# EasyEDA schematic SCH_Piano touch sensor_2021-10-13.json
TITLE: Sheet_1; REV: 1.0; Date: 2021-10-09; Sheet: 1/1; Drawn By: limchengwei; Company: Your Company
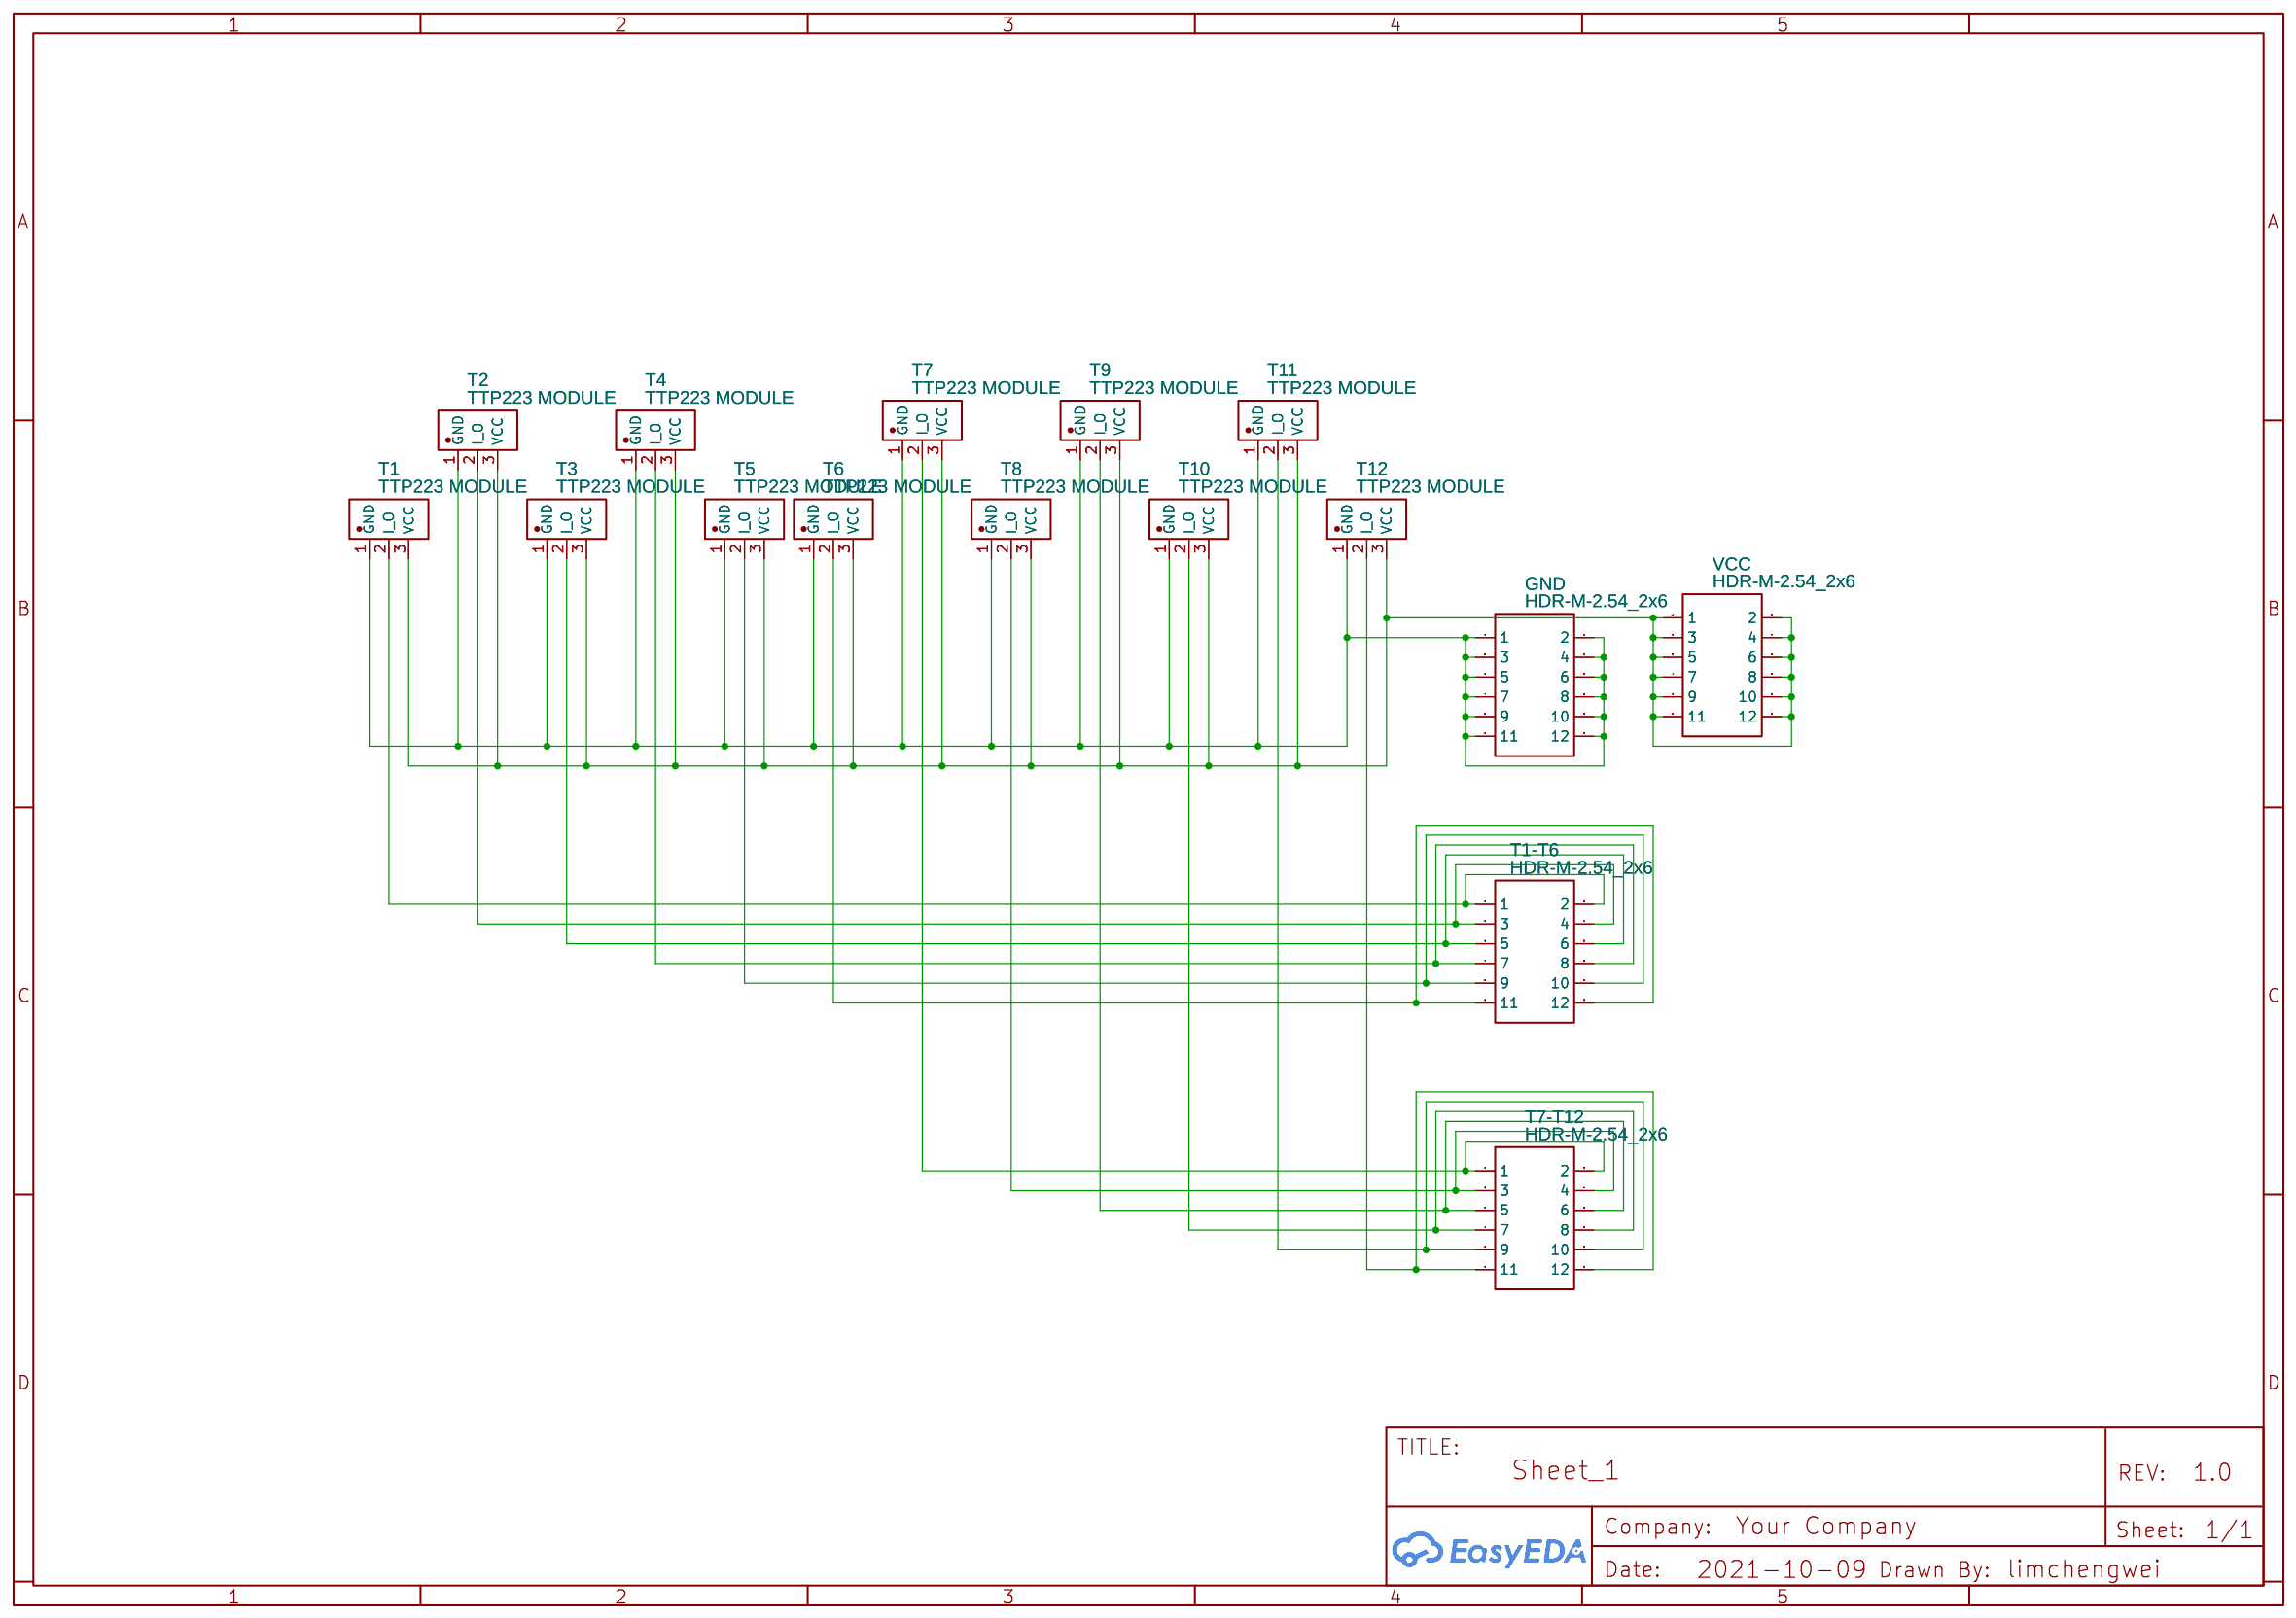
[diagram p0: schematic sheet]

## Parts
GND  HDR-M-2.54_2x6  [HDR-M-2.54_2X6]
T1  TTP223 MODULE  [TOUCH SENSOR  MODULE]
T1-T6  HDR-M-2.54_2x6  [HDR-M-2.54_2X6]
T2  TTP223 MODULE  [TOUCH SENSOR  MODULE]
T3  TTP223 MODULE  [TOUCH SENSOR  MODULE]
T4  TTP223 MODULE  [TOUCH SENSOR  MODULE]
T5  TTP223 MODULE  [TOUCH SENSOR  MODULE]
T6  TTP223 MODULE  [TOUCH SENSOR  MODULE]
T7  TTP223 MODULE  [TOUCH SENSOR  MODULE]
T7-T12  HDR-M-2.54_2x6  [HDR-M-2.54_2X6]
T8  TTP223 MODULE  [TOUCH SENSOR  MODULE]
T9  TTP223 MODULE  [TOUCH SENSOR  MODULE]
T10  TTP223 MODULE  [TOUCH SENSOR  MODULE]
T11  TTP223 MODULE  [TOUCH SENSOR  MODULE]
T12  TTP223 MODULE  [TOUCH SENSOR  MODULE]
VCC  HDR-M-2.54_2x6  [HDR-M-2.54_2X6]

## Library data of the parts
GND T1-T6 T7-T12 VCC = HDR-M-2.54_2x6: Supplier Part: C124388; Supplier: LCSC; Contributor: LCEDA_Lib
T1-T12 = TTP223 MODULE: Manufacturer: ReliaPro; Manufacturer Part: WJ2EDGVC-5.08-3P; image: //image.lceda.cn/szlcsc/C8430.jpg; Supplier Part: C8430; libConvert: Yes; Add into BOM: Yes

## Nets
Net-(GND-1): GND.1 GND.2 GND.3 GND.4 GND.5 GND.6 GND.7 GND.8 GND.9 GND.10 GND.11 GND.12 T1.1(GND) T2.1(GND) T3.1(GND) T4.1(GND) T5.1(GND) T6.1(GND) T7.1(GND) T8.1(GND) T9.1(GND) T10.1(GND) T11.1(GND) T12.1(GND)
Net-(T1-2): T1.2(I O) T1-T6.1 T1-T6.2
Net-(T1-3): T1.3(VCC) T2.3(VCC) T3.3(VCC) T4.3(VCC) T5.3(VCC) T6.3(VCC) T7.3(VCC) T8.3(VCC) T9.3(VCC) T10.3(VCC) T11.3(VCC) T12.3(VCC) VCC.1 VCC.2 VCC.3 VCC.4 VCC.5 VCC.6 VCC.7 VCC.8 VCC.9 VCC.10 VCC.11 VCC.12
Net-(T1-T6-3): T1-T6.3 T1-T6.4 T2.2(I O)
Net-(T1-T6-5): T1-T6.5 T1-T6.6 T3.2(I O)
Net-(T1-T6-7): T1-T6.7 T1-T6.8 T4.2(I O)
Net-(T1-T6-9): T1-T6.9 T1-T6.10 T5.2(I O)
Net-(T1-T6-11): T1-T6.11 T1-T6.12 T6.2(I O)
Net-(T7-2): T7.2(I O) T7-T12.1 T7-T12.2
Net-(T7-T12-3): T7-T12.3 T7-T12.4 T8.2(I O)
Net-(T7-T12-5): T7-T12.5 T7-T12.6 T9.2(I O)
Net-(T7-T12-7): T7-T12.7 T7-T12.8 T10.2(I O)
Net-(T7-T12-9): T7-T12.9 T7-T12.10 T11.2(I O)
Net-(T7-T12-11): T7-T12.11 T7-T12.12 T12.2(I O)
